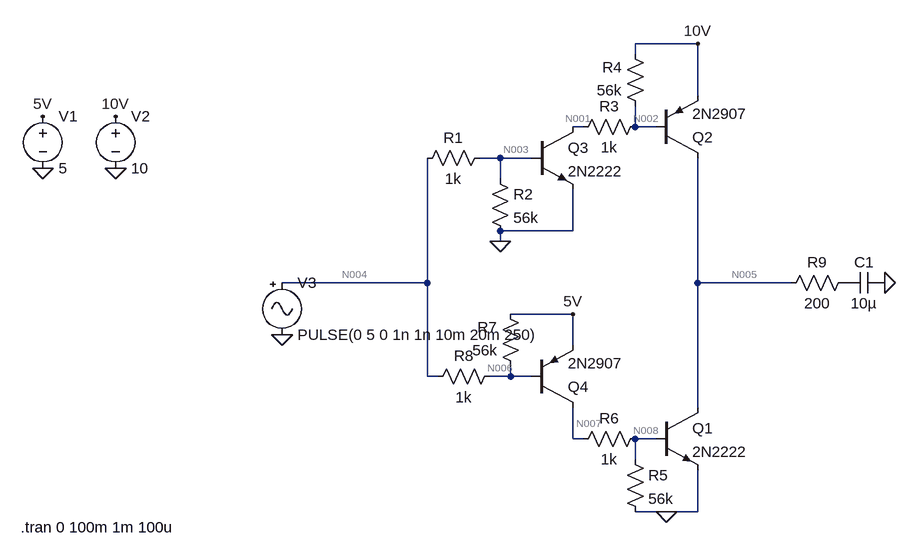
[diagram p0: schematic MosfetDriverAntiLatchup.asc]
MosfetDriverAntiLatchup.asc, the LTspice schematic file:
Version 4
SHEET 1 880 680
WIRE 96 -384 0 -384
WIRE 0 -368 0 -384
WIRE 96 -304 96 -384
WIRE -80 -256 -96 -256
WIRE 0 -256 0 -288
WIRE 32 -256 0 -256
WIRE -208 -208 -240 -208
WIRE -160 -208 -208 -208
WIRE -208 -176 -208 -208
WIRE -96 -96 -96 -160
WIRE -96 -96 -208 -96
WIRE -208 -80 -208 -96
WIRE -320 -16 -320 -208
WIRE -320 -16 -544 -16
WIRE 96 -16 96 -208
WIRE 240 -16 96 -16
WIRE -96 32 -192 32
WIRE -96 80 -96 32
WIRE -320 128 -320 -16
WIRE -304 128 -320 128
WIRE -192 128 -192 112
WIRE -192 128 -224 128
WIRE -160 128 -192 128
WIRE 96 176 96 -16
WIRE -96 224 -96 176
WIRE -80 224 -96 224
WIRE 32 224 0 224
WIRE 0 256 0 224
WIRE 48 336 0 336
WIRE 96 336 96 272
WIRE 96 336 48 336
FLAG -912 -192 0
FLAG -912 -272 5V
FLAG -800 -192 0
FLAG -800 -272 10V
FLAG -208 -80 0
FLAG -96 32 5V
FLAG 48 336 0
FLAG -544 64 0
FLAG 96 -384 10V
FLAG 384 -16 0
SYMBOL npn 32 176 R0
SYMATTR InstName Q1
SYMATTR Value 2N2222
SYMBOL pnp 32 -208 M180
SYMATTR InstName Q2
SYMATTR Value 2N2907
SYMBOL npn -160 -256 R0
SYMATTR InstName Q3
SYMATTR Value 2N2222
SYMBOL pnp -160 176 M180
SYMATTR InstName Q4
SYMATTR Value 2N2907
SYMBOL voltage -912 -288 R0
WINDOW 123 0 0 Left 0
WINDOW 39 0 0 Left 0
SYMATTR InstName V1
SYMATTR Value 5
SYMBOL voltage -800 -288 R0
WINDOW 123 0 0 Left 0
WINDOW 39 0 0 Left 0
SYMATTR InstName V2
SYMATTR Value 10
SYMBOL res -224 -224 R90
WINDOW 0 0 56 VBottom 2
WINDOW 3 32 56 VTop 2
SYMATTR InstName R1
SYMATTR Value 1k
SYMBOL res -224 -192 R0
SYMATTR InstName R2
SYMATTR Value 56k
SYMBOL res 16 -272 R90
WINDOW 0 0 56 VBottom 2
WINDOW 3 32 56 VTop 2
SYMATTR InstName R3
SYMATTR Value 1k
SYMBOL res 16 -272 R180
WINDOW 0 36 76 Left 2
WINDOW 3 36 40 Left 2
SYMATTR InstName R4
SYMATTR Value 56k
SYMBOL res -16 240 R0
SYMATTR InstName R5
SYMATTR Value 56k
SYMBOL res 16 208 R90
WINDOW 0 0 56 VBottom 2
WINDOW 3 32 56 VTop 2
SYMATTR InstName R6
SYMATTR Value 1k
SYMBOL res -176 128 R180
WINDOW 0 36 76 Left 2
WINDOW 3 36 40 Left 2
SYMATTR InstName R7
SYMATTR Value 56k
SYMBOL res -208 112 R90
WINDOW 0 0 56 VBottom 2
WINDOW 3 32 56 VTop 2
SYMATTR InstName R8
SYMATTR Value 1k
SYMBOL Misc\\signal -544 -32 R0
WINDOW 123 0 0 Left 0
WINDOW 39 0 0 Left 0
SYMATTR InstName V3
SYMATTR Value PULSE(0 5 0 1n 1n 10m 20m 250)
SYMBOL res 336 -32 R90
WINDOW 0 0 56 VBottom 2
WINDOW 3 32 56 VTop 2
SYMATTR InstName R9
SYMATTR Value 200
SYMBOL cap 384 -32 R90
WINDOW 0 0 32 VBottom 2
WINDOW 3 32 32 VTop 2
SYMATTR InstName C1
SYMATTR Value 10µ
TEXT -946 360 Left 2 !.tran 0 100m 1m 100u

The netlist it stands for:
* MosfetDriverAntiLatchup.asc
Q1 N005 N008 0 0 2N2222
Q2 N005 N002 10V 0 2N2907
Q3 N001 N003 0 0 2N2222
Q4 N007 N006 5V 0 2N2907
V1 5V 0 5
V2 10V 0 10
R1 N003 N004 1k
R2 N003 0 56k
R3 N002 N001 1k
R4 N002 10V 56k
R5 N008 0 56k
R6 N008 N007 1k
R7 N006 5V 56k
R8 N006 N004 1k
V3 N004 0 PULSE(0 5 0 1n 1n 10m 20m 250)
R9 P001 N005 200
C1 0 P001 10µ
.model NPN NPN
.model PNP PNP
.lib standard.bjt
.tran 0 100m 1m 100u
.backanno
.end

* Results of the author's LTspice run, read from the files saved beside the schematic
* Operating Point, zero values left out:
*   V(n005) = 8.669 mV
*   V(n008) = 770.8 mV
*   V(n002) = 10 V
*   V(10v) = 10 V
*   V(n001) = 10 V
*   V(n007) = 4.983 V
*   V(n006) = 4.222 V
*   V(5v) = 5 V
*   V(p001) = 8.669 mV
*   Ic(Q4) = -4.212 mA
*   Ib(Q4) = -4.208 mA
*   Ie(Q4) = 8.42 mA
*   Ic(Q2) = -10.01 pA
*   Ib(Q2) = 9.995 pA
*   Ic(Q3) = 10.02 pA
*   Ib(Q3) = -10 pA
*   Ic(Q1) = 10.01 pA
*   Ib(Q1) = 4.198 mA
*   Ie(Q1) = -4.198 mA
*   I(R8) = 4.222 mA
*   I(R7) = -13.89 µA
*   I(R6) = -4.212 mA
*   I(R5) = 13.76 µA
*   I(R4) = -20.01 pA
*   I(R3) = 10.01 pA
*   I(R1) = 9.828 pA
*   I(V3) = 4.222 mA
*   I(V2) = -20.01 pA
*   I(V1) = -8.434 mA
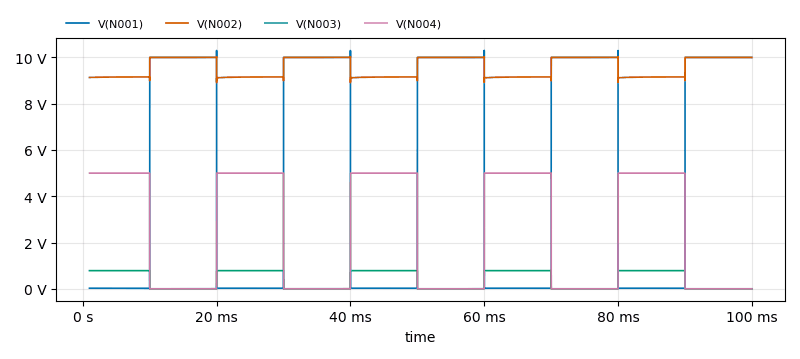
[diagram p1: Transient Analysis of MosfetDriverAntiLatchup.asc, plotted from the saved traces]
* Transient Analysis, 1 run:
*   V(N001): min 18.75 mV, max 10.31 V, average 5.063 V, rms 7.106 V, last 10 V
*   V(N002): min 8.916 V, max 10.03 V, average 9.58 V, rms 9.589 V, last 10 V
*   V(N003): min -3.028 µV, max 784.7 mV, average 388.4 mV, rms 552 mV, last 0 V
*   V(N004): min 0 V, max 5 V, average 2.475 V, rms 3.518 V, last 0 V